# Altium schematic sheet test_anta.SchDoc
size A4
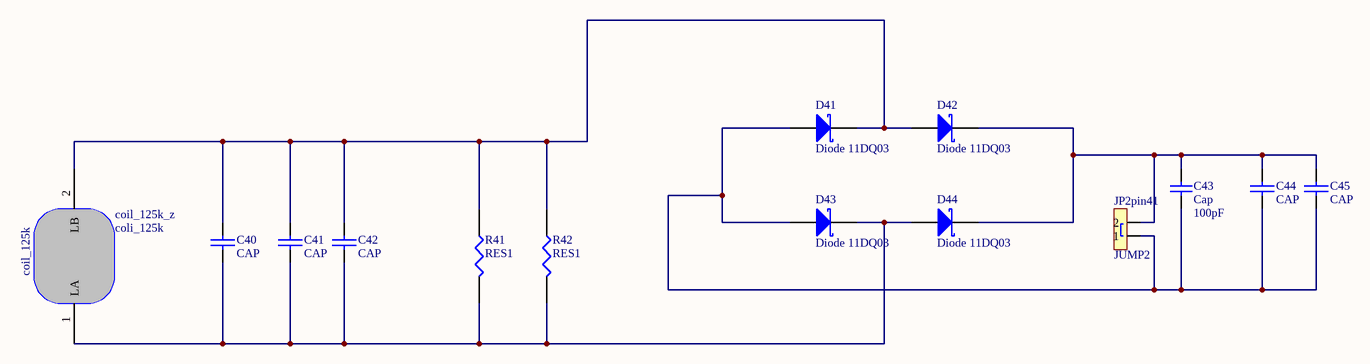
[diagram p0: test_anta.SchDoc]

## Parts
C40  CAP  [C0805]
C41  CAP  [C0805]
C42  CAP  [RAD-0.3]
C43  Cap  value 100pF  [RAD-0.3]
C44  CAP  [C0805]
C45  CAP  [C0805]
coil_125k_z  coli_125k  [coil_125k]
D41  Diode 11DQ03  [DO-204AL]
D42  Diode 11DQ03  [DO-204AL]
D43  Diode 11DQ03  [DO-204AL]
D44  Diode 11DQ03  [DO-204AL]
JP2pin41  JUMP2  [HDR1X2]
R41  RES1  [0805]
R42  RES1  [0805]

## Nets
NetC40_1: C40.1 C41.1 C42.1 coil_125k_z.2(LB) D41.2(K) D42.1(A) R41.1 R42.1
NetC40_2: C40.2 C41.2 C42.2 coil_125k_z.1(LA) D43.2(K) D44.1(A) R41.2 R42.2
NetC43_1: C43.1 C44.2 C45.2 D41.1(A) D43.1(A) JP2pin41.1
NetC43_2: C43.2 C44.1 C45.1 D42.2(K) D44.2(K) JP2pin41.2

## Notes on the sheet
- (in symbol coli_125k) coil_125k

## Library data of the parts
C40-C42 C44 C45 = CAP: 一般瓷片电容、直插选用RAD0.1，贴片选用0805
C43 = Cap: Capacitor; Published: 8-Jun-2000; LatestRevisionDate: 17-Jul-2002; LatestRevisionNote: Re-released for DXP Platform.; PackageReference: RAD-0.3; Publisher: Altium Limited; PackageDescription: Radial Cap, Thru-Hole; 2 Leads; 0.3 in Pin Spacing
D41-D44 = Diode 11DQ03: Schottky Rectifier; Published: 8-Jun-2000; LatestRevisionDate: 17-Jul-2002; LatestRevisionNote: Re-released for DXP Platform.; DatasheetVersion: Dec-1997; PackageReference: DO-204AL; Publisher: Altium Limited; PackageDescription: Diode, Axial; Body 5.2 x 2.7 mm (LxDia. max), Lead Dia. 0.86 mm (max); Code_JEDEC: DO-204-AL; ComponentLink1Description: Manufacturer Link; ComponentLink1URL: http://www.irf.com/; ComponentLink2Description: Datasheet; ComponentLink2URL: http://www.irf.com/product-info/datasheets/data/11dq03.pdf
JP2pin41 = JUMP2: 单线跳线（短路）连接器，一般使用SIP2即可，当需要标示插件方向时可选SIP2-ST（间距2.54mm），当需要作短路线使用时可用SIP2-EASY-SHORT（间距2.54mm）
R41 R42 = RES1: 电阻，1/4w的金属膜直插可选AXIAL0.4封装（长度10mm），贴片可选0805封装，其他电阻可选AXIAL0.5～AXIAL1.0